# Altium schematic sheet 10-Buffer.SchDoc
size A4
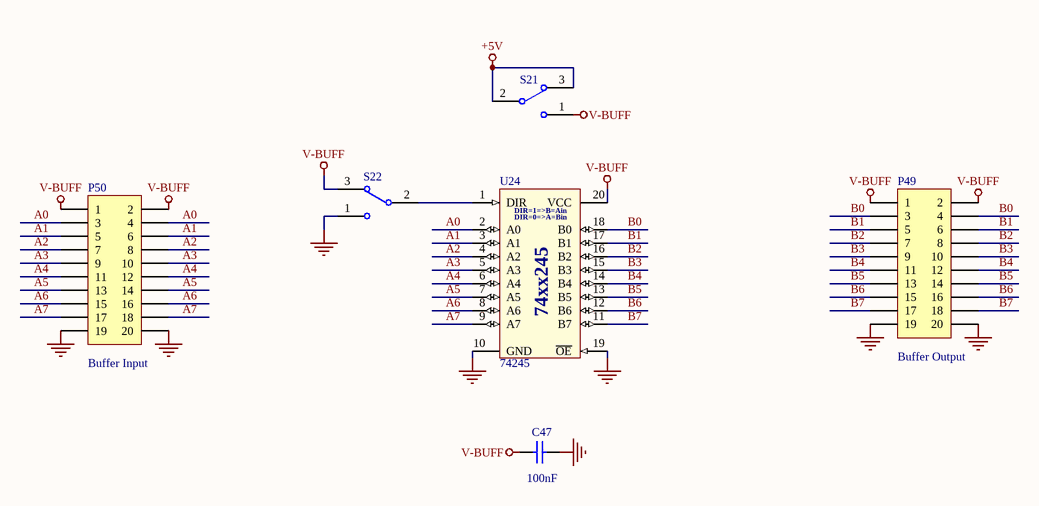
[diagram p0: 10-Buffer.SchDoc]

## Parts
C47  value 100nF  [C-0805]  (hidden comment: 104)
P49  value Buffer Output  [HDR2X10]  (hidden comment: H10X2)
P50  value Buffer Input  [HDR2X10]  (hidden comment: H10X2)
S21  SW-SPDT  [SW-DIP1SMD]  (value not drawn)
S22  SW-SPDT  [SW-DIP1SMD]  (value not drawn)
U24  74245  [DIP20/W0.3]

## Nets
+5V: S21.2 S21.3
GND: C47.2 P49.19 P49.20 P50.19 P50.20 S22.1 U24.10(GND) U24.19(~{OE})
V-BUFF: C47.1 P49.1 P49.2 P50.1 P50.2 S21.1 S22.3 U24.20(VCC)
A0: P50.3 P50.4 U24.2(A0)
A1: P50.5 P50.6 U24.3(A1)
A2: P50.7 P50.8 U24.4(A2)
A3: P50.9 P50.10 U24.5(A3)
A4: P50.11 P50.12 U24.6(A4)
A5: P50.13 P50.14 U24.7(A5)
A6: P50.15 P50.16 U24.8(A6)
A7: P50.17 P50.18 U24.9(A7)
B0: P49.3 P49.4 U24.18(B0)
B1: P49.5 P49.6 U24.17(B1)
B2: P49.7 P49.8 U24.16(B2)
B3: P49.9 P49.10 U24.15(B3)
B4: P49.11 P49.12 U24.14(B4)
B5: P49.13 P49.14 U24.13(B5)
B6: P49.15 P49.16 U24.12(B6)
B7: P49.17 P49.18 U24.11(B7)
NetS22_2: S22.2 U24.1(DIR)

## Notes on the sheet
- (in symbol 74245) DIR=1=>B=Ain; DIR=0=>A=Bin; 74xx245

## Library data of the parts
C47 = Cap: Capacitor; Published: 8-Jun-2000; LatestRevisionDate: 17-Jul-2002; LatestRevisionNote: Re-released for DXP Platform.; PackageReference: RAD-0.3; Publisher: Altium Limited; PackageDescription: Radial Cap, Thru-Hole; 2 Leads; 0.3 in Pin Spacing
P49 P50 = Header 10X2: Header, 10-Pin, Dual row; LatestRevisionDate: 17-Jul-2002; LatestRevisionNote: Re-released for DXP Platform.
S21 S22 = SW-SPDT: SPDT Subminiature Toggle Switch, Right Angle Mounting, Vertical Actuation; Published: 24-Mar-1999; LatestRevisionDate: 17-Dec-2003; LatestRevisionNote: Schematic revised, PCB Footprint replaced.; DatasheetVersion: 05-Dec-2000; PackageReference: TL36WW15050; Publisher: Altium Limited; PackageDescription: Switch; 4 Leads; ComponentLink1Description: Manufacturer Link; ComponentLink1URL: http://www.apem.com
U24 = 74245: Octal bus tranceiver; 3-state; Copyright by: VanDungEvn@gmail.com